# Altium project SLAVE_HW.PrjPcb (part 2 of 3)

## Sheet [2]Balancing.SchDoc
size A4 portrait; DocumentNumber: 3; SheetNumber: 3; SheetTotal: 5
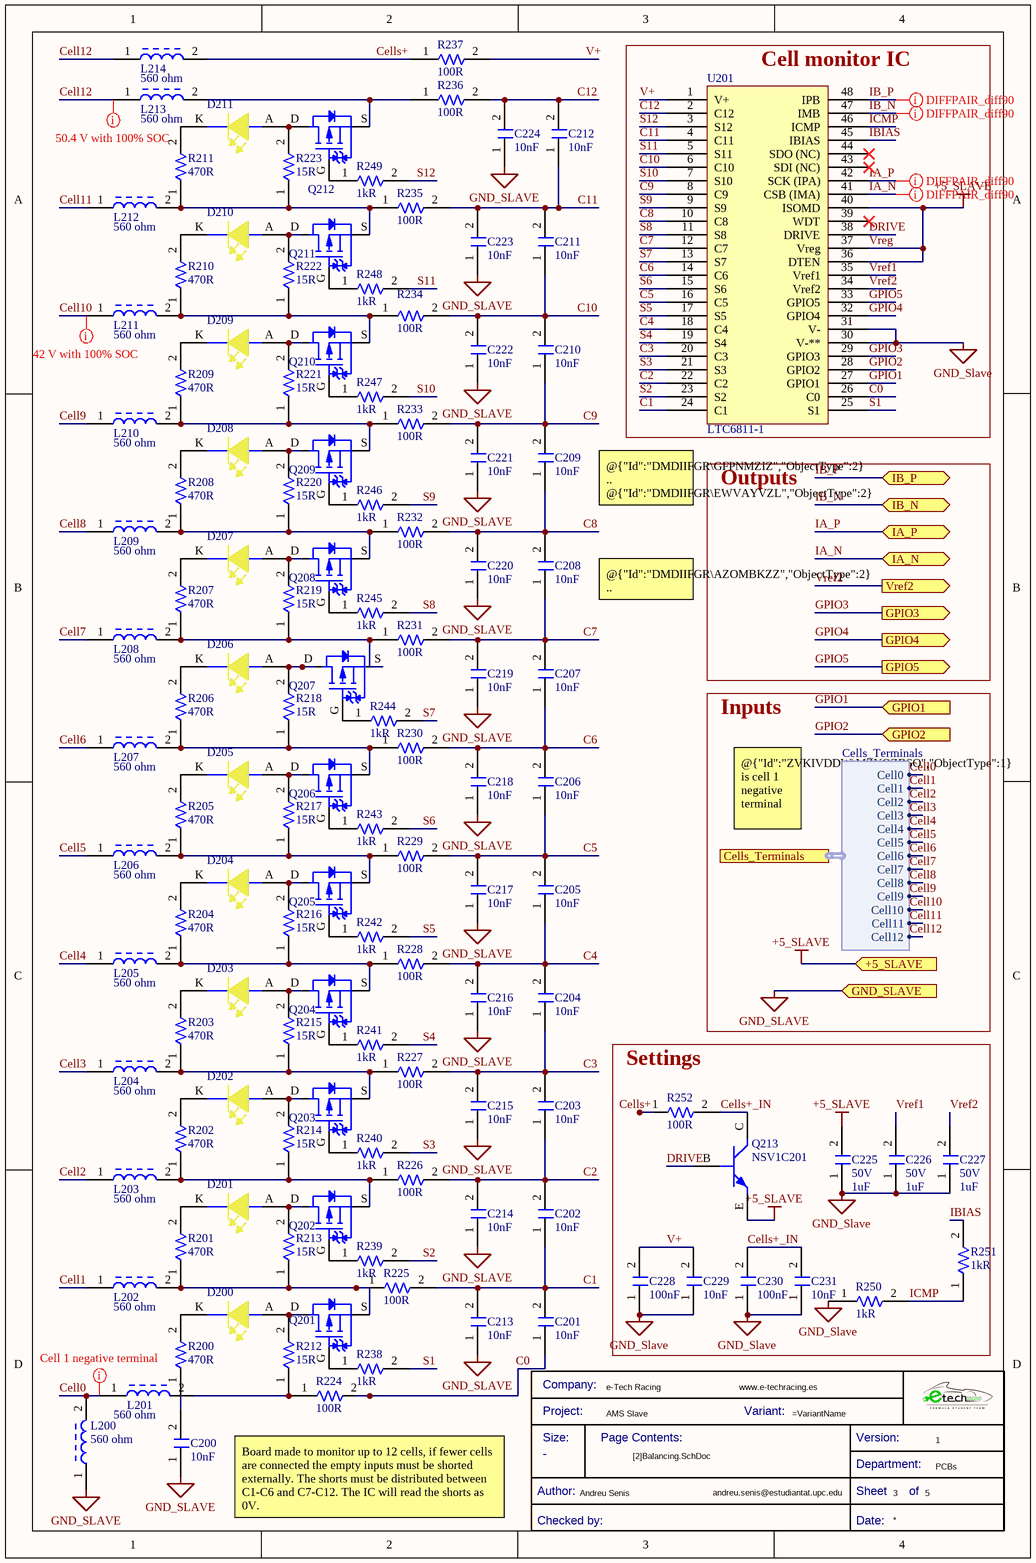
[diagram p1: [2]Balancing.SchDoc]

### Parts
(Parts that share a designator on the sheet are numbered #1, #2 ... from top to bottom, then left to right.)
*#2  Title Block_template  (value not drawn)  (graphical)
C200  Capacitance: 10nF  [C0805FNPC-R]  (hidden comment: 885012207122)
C201  Capacitance: 10nF  [C0805FNPC-R]  (hidden comment: 885012207122)
C202  Capacitance: 10nF  [C0805FNPC-R]  (hidden comment: 885012207122)
C203  Capacitance: 10nF  [C0805FNPC-R]  (hidden comment: 885012207122)
C204  Capacitance: 10nF  [C0805FNPC-R]  (hidden comment: 885012207122)
C205  Capacitance: 10nF  [C0805FNPC-R]  (hidden comment: 885012207122)
C206  Capacitance: 10nF  [C0805FNPC-R]  (hidden comment: 885012207122)
C207  Capacitance: 10nF  [C0805FNPC-R]  (hidden comment: 885012207122)
C208  Capacitance: 10nF  [C0805FNPC-R]  (hidden comment: 885012207122)
C209  Capacitance: 10nF  [C0805FNPC-R]  (hidden comment: 885012207122)
C210  Capacitance: 10nF  [C0805FNPC-R]  (hidden comment: 885012207122)
C211  Capacitance: 10nF  [C0805FNPC-R]  (hidden comment: 885012207122)
C212  Capacitance: 10nF  [C0805FNPC-R]  (hidden comment: 885012207122)
C213  Capacitance: 10nF  [C0805FNPC-R]  (hidden comment: 885012207122)
C214  Capacitance: 10nF  [C0805FNPC-R]  (hidden comment: 885012207122)
C215  Capacitance: 10nF  [C0805FNPC-R]  (hidden comment: 885012207122)
C216  Capacitance: 10nF  [C0805FNPC-R]  (hidden comment: 885012207122)
C217  Capacitance: 10nF  [C0805FNPC-R]  (hidden comment: 885012207122)
C218  Capacitance: 10nF  [C0805FNPC-R]  (hidden comment: 885012207122)
C219  Capacitance: 10nF  [C0805FNPC-R]  (hidden comment: 885012207122)
C220  Capacitance: 10nF  [C0805FNPC-R]  (hidden comment: 885012207122)
C221  Capacitance: 10nF  [C0805FNPC-R]  (hidden comment: 885012207122)
C222  Capacitance: 10nF  [C0805FNPC-R]  (hidden comment: 885012207122)
C223  Capacitance: 10nF  [C0805FNPC-R]  (hidden comment: 885012207122)
C224  Capacitance: 10nF  [C0805FNPC-R]  (hidden comment: 885012207122)
C225  Voltage Rating: 50V  Capacitance: 1uF  [C0805FNPC-R]  (hidden comment: 885012207103)
C226  Voltage Rating: 50V  Capacitance: 1uF  [C0805FNPC-R]  (hidden comment: 885012207103)
C227  Voltage Rating: 50V  Capacitance: 1uF  [C0805FNPC-R]  (hidden comment: 885012207103)
C228  Capacitance: 100nF  [C0805FNPC-R]  (hidden comment: 885012207128)
C229  Capacitance: 10nF  [C0805FNPC-R]  (hidden comment: 885012207122)
C230  Capacitance: 100nF  [C0805FNPC-R]  (hidden comment: 885012207128)
C231  Capacitance: 10nF  [C0805FNPC-R]  (hidden comment: 885012207122)
D200  150080YS75000  [LED_0805_WE]  (value not drawn)
D201  150080YS75000  [LED_0805_WE]  (value not drawn)
D202  150080YS75000  [LED_0805_WE]  (value not drawn)
D203  150080YS75000  [LED_0805_WE]  (value not drawn)
D204  150080YS75000  [LED_0805_WE]  (value not drawn)
D205  150080YS75000  [LED_0805_WE]  (value not drawn)
D206  150080YS75000  [LED_0805_WE]  (value not drawn)
D207  150080YS75000  [LED_0805_WE]  (value not drawn)
D208  150080YS75000  [LED_0805_WE]  (value not drawn)
D209  150080YS75000  [LED_0805_WE]  (value not drawn)
D210  150080YS75000  [LED_0805_WE]  (value not drawn)
D211  150080YS75000  [LED_0805_WE]  (value not drawn)
L200  560 ohm  [L_Ferrite_bead_0805]
L201  560 ohm  [L_Ferrite_bead_0805]
L202  560 ohm  [L_Ferrite_bead_0805]
L203  560 ohm  [L_Ferrite_bead_0805]
L204  560 ohm  [L_Ferrite_bead_0805]
L205  560 ohm  [L_Ferrite_bead_0805]
L206  560 ohm  [L_Ferrite_bead_0805]
L207  560 ohm  [L_Ferrite_bead_0805]
L208  560 ohm  [L_Ferrite_bead_0805]
L209  560 ohm  [L_Ferrite_bead_0805]
L210  560 ohm  [L_Ferrite_bead_0805]
L211  560 ohm  [L_Ferrite_bead_0805]
L212  560 ohm  [L_Ferrite_bead_0805]
L213  560 ohm  [L_Ferrite_bead_0805]
L214  560 ohm  [L_Ferrite_bead_0805]
Q201  BSS308PE  [TRT-PCH-2/30-BSS]  (value not drawn)
Q202  BSS308PE  [TRT-PCH-2/30-BSS]  (value not drawn)
Q203  BSS308PE  [TRT-PCH-2/30-BSS]  (value not drawn)
Q204  BSS308PE  [TRT-PCH-2/30-BSS]  (value not drawn)
Q205  BSS308PE  [TRT-PCH-2/30-BSS]  (value not drawn)
Q206  BSS308PE  [TRT-PCH-2/30-BSS]  (value not drawn)
Q207  BSS308PE  [TRT-PCH-2/30-BSS]  (value not drawn)
Q208  BSS308PE  [TRT-PCH-2/30-BSS]  (value not drawn)
Q209  BSS308PE  [TRT-PCH-2/30-BSS]  (value not drawn)
Q210  BSS308PE  [TRT-PCH-2/30-BSS]  (value not drawn)
Q211  BSS308PE  [TRT-PCH-2/30-BSS]  (value not drawn)
Q212  BSS308PE  [TRT-PCH-2/30-BSS]  (value not drawn)
Q213  NSV1C201  [TRT-NPN-2/100-SOT23_1]
R200  Resistance: 470R  [R0805FTK]  (hidden comment: CR0805-FX-4700GLF)
R201  Resistance: 470R  [R0805FTK]  (hidden comment: CR0805-FX-4700GLF)
R202  Resistance: 470R  [R0805FTK]  (hidden comment: CR0805-FX-4700GLF)
R203  Resistance: 470R  [R0805FTK]  (hidden comment: CR0805-FX-4700GLF)
R204  Resistance: 470R  [R0805FTK]  (hidden comment: CR0805-FX-4700GLF)
R205  Resistance: 470R  [R0805FTK]  (hidden comment: CR0805-FX-4700GLF)
R206  Resistance: 470R  [R0805FTK]  (hidden comment: CR0805-FX-4700GLF)
R207  Resistance: 470R  [R0805FTK]  (hidden comment: CR0805-FX-4700GLF)
R208  Resistance: 470R  [R0805FTK]  (hidden comment: CR0805-FX-4700GLF)
R209  Resistance: 470R  [R0805FTK]  (hidden comment: CR0805-FX-4700GLF)
R210  Resistance: 470R  [R0805FTK]  (hidden comment: CR0805-FX-4700GLF)
R211  Resistance: 470R  [R0805FTK]  (hidden comment: CR0805-FX-4700GLF)
R212  value 15R  [R2512FTK]  (hidden comment: 352115RFT)
R213  value 15R  [R2512FTK]  (hidden comment: 352115RFT)
R214  value 15R  [R2512FTK]  (hidden comment: 352115RFT)
R215  value 15R  [R2512FTK]  (hidden comment: 352115RFT)
R216  value 15R  [R2512FTK]  (hidden comment: 352115RFT)
R217  value 15R  [R2512FTK]  (hidden comment: 352115RFT)
R218  value 15R  [R2512FTK]  (hidden comment: 352115RFT)
R219  value 15R  [R2512FTK]  (hidden comment: 352115RFT)
R220  value 15R  [R2512FTK]  (hidden comment: 352115RFT)
R221  value 15R  [R2512FTK]  (hidden comment: 352115RFT)
R222  value 15R  [R2512FTK]  (hidden comment: 352115RFT)
R223  value 15R  [R2512FTK]  (hidden comment: 352115RFT)
R224  Resistance: 100R  [R0805FTK]  (hidden comment: CR0805-FX-1000ELF)
R225  Resistance: 100R  [R0805FTK]  (hidden comment: CR0805-FX-1000ELF)
R226  Resistance: 100R  [R0805FTK]  (hidden comment: CR0805-FX-1000ELF)
R227  Resistance: 100R  [R0805FTK]  (hidden comment: CR0805-FX-1000ELF)
R228  Resistance: 100R  [R0805FTK]  (hidden comment: CR0805-FX-1000ELF)
R229  Resistance: 100R  [R0805FTK]  (hidden comment: CR0805-FX-1000ELF)
R230  Resistance: 100R  [R0805FTK]  (hidden comment: CR0805-FX-1000ELF)
R231  Resistance: 100R  [R0805FTK]  (hidden comment: CR0805-FX-1000ELF)
R232  Resistance: 100R  [R0805FTK]  (hidden comment: CR0805-FX-1000ELF)
R233  Resistance: 100R  [R0805FTK]  (hidden comment: CR0805-FX-1000ELF)
R234  Resistance: 100R  [R0805FTK]  (hidden comment: CR0805-FX-1000ELF)
R235  Resistance: 100R  [R0805FTK]  (hidden comment: CR0805-FX-1000ELF)
R236  Resistance: 100R  [R0805FTK]  (hidden comment: CR0805-FX-1000ELF)
R237  Resistance: 100R  [R0805FTK]  (hidden comment: CR0805-FX-1000ELF)
R238  Resistance: 1kR  [R0805FTK]  (hidden comment: CR0805-JW-102ELF)
R239  Resistance: 1kR  [R0805FTK]  (hidden comment: CR0805-JW-102ELF)
R240  Resistance: 1kR  [R0805FTK]  (hidden comment: CR0805-JW-102ELF)
R241  Resistance: 1kR  [R0805FTK]  (hidden comment: CR0805-JW-102ELF)
R242  Resistance: 1kR  [R0805FTK]  (hidden comment: CR0805-JW-102ELF)
R243  Resistance: 1kR  [R0805FTK]  (hidden comment: CR0805-JW-102ELF)
R244  Resistance: 1kR  [R0805FTK]  (hidden comment: CR0805-JW-102ELF)
R245  Resistance: 1kR  [R0805FTK]  (hidden comment: CR0805-JW-102ELF)
R246  Resistance: 1kR  [R0805FTK]  (hidden comment: CR0805-JW-102ELF)
R247  Resistance: 1kR  [R0805FTK]  (hidden comment: CR0805-JW-102ELF)
R248  Resistance: 1kR  [R0805FTK]  (hidden comment: CR0805-JW-102ELF)
R249  Resistance: 1kR  [R0805FTK]  (hidden comment: CR0805-JW-102ELF)
R250  Resistance: 1kR  [R0805FTK]  (hidden comment: CR0805-JW-102ELF)
R251  Resistance: 1kR  [R0805FTK]  (hidden comment: CR0805-JW-102ELF)
R252  Resistance: 100R  [R0805FTK]  (hidden comment: CR0805-FX-1000ELF)
U201  LTC6811-1  [U_LTC6811G-2]

### Blocks framed on the sheet
Cell monitor IC: U201
Settings: C225-C231 Q213 R250-R252

### Ports
+5_SLAVE (in), Cells_Terminals (harness Cells_Terminals), GND_SLAVE (in), GPIO1 (in), GPIO2 (in), GPIO3 (out), GPIO4 (out), GPIO5 (out), IA_N (bidir), IA_P (bidir), IB_N (bidir), IB_P (bidir), Vref2 (out)

### Harnesses
Cells_Terminals: Cell0, Cell1, Cell2, Cell3, Cell4, Cell5, Cell6, Cell7, Cell8, Cell9, Cell10, Cell11, Cell12

### Nets
GND_SLAVE: C200.1 C213.1 C214.1 C215.1 C216.1 C217.1 C218.1 C219.1 C220.1 C221.1 C222.1 C223.1 C224.1 C225.1 C226.1 C227.1 C228.1 C229.1 C230.1 C231.1 L200.1 R250.1 U201.30(V-**) U201.31(V-) ; port GND_SLAVE
Vreg: C225.2 Q213.E U201.36(DTEN) U201.37(Vreg) U201.40(ISOMD) ; port +5_SLAVE  [also labelled +5_SLAVE]
C0: C201.1 R224.2 U201.26(C0)
C1: C201.2 C202.1 C213.2 R225.2 U201.24(C1)
C2: C202.2 C203.1 C214.2 R226.2 U201.22(C2)
C3: C203.2 C204.1 C215.2 R227.2 U201.20(C3)
C4: C204.2 C205.1 C216.2 R228.2 U201.18(C4)
C5: C205.2 C206.1 C217.2 R229.2 U201.16(C5)
C6: C206.2 C207.1 C218.2 R230.2 U201.14(C6)
C7: C207.2 C208.1 C219.2 R231.2 U201.12(C7)
C8: C208.2 C209.1 C220.2 R232.2 U201.10(C8)
C9: C209.2 C210.1 C221.2 R233.2 U201.8(C9)
C10: C210.2 C211.1 C222.2 R234.2 U201.6(C10)
C11: C211.2 C212.1 C223.2 R235.2 U201.4(C11)
C12: C212.2 C224.2 R236.2 U201.2(C12)
Cell0: L200.2 L201.1 ; port Cells_Terminals.Cell0
Cell1: L202.1 ; port Cells_Terminals.Cell1
Cell2: L203.1 ; port Cells_Terminals.Cell2
Cell3: L204.1 ; port Cells_Terminals.Cell3
Cell4: L205.1 ; port Cells_Terminals.Cell4
Cell5: L206.1 ; port Cells_Terminals.Cell5
Cell6: L207.1 ; port Cells_Terminals.Cell6
Cell7: L208.1 ; port Cells_Terminals.Cell7
Cell8: L209.1 ; port Cells_Terminals.Cell8
Cell9: L210.1 ; port Cells_Terminals.Cell9
Cell10: L211.1 ; port Cells_Terminals.Cell10
Cell11: L212.1 ; port Cells_Terminals.Cell11
Cell12: L213.1 L214.1 ; port Cells_Terminals.Cell12
Cells+: L214.2 R237.1 R252.1
Cells+_IN: C230.2 C231.2 Q213.C R252.2
DRIVE: Q213.B U201.38(DRIVE)
GPIO1: U201.27(GPIO1) ; port GPIO1
GPIO2: U201.28(GPIO2) ; port GPIO2
GPIO3: U201.29(GPIO3) ; port GPIO3
GPIO4: U201.32(GPIO4) ; port GPIO4
GPIO5: U201.33(GPIO5) ; port GPIO5
IA_N: U201.41(CSB_(IMA)) ; port IA_N
IA_P: U201.42(SCK_(IPA)) ; port IA_P
IB_N: U201.47(IMB) ; port IB_N
IB_P: U201.48(IPB) ; port IB_P
IBIAS: R251.2 U201.45(IBIAS)
ICMP: R250.2 R251.1 U201.46(ICMP)
S1: R238.2 U201.25(S1)
S2: R239.2 U201.23(S2)
S3: R240.2 U201.21(S3)
S4: R241.2 U201.19(S4)
S5: R242.2 U201.17(S5)
S6: R243.2 U201.15(S6)
S7: R244.2 U201.13(S7)
S8: R245.2 U201.11(S8)
S9: R246.2 U201.9(S9)
S10: R247.2 U201.7(S10)
S11: R248.2 U201.5(S11)
S12: R249.2 U201.3(S12)
V+: C228.2 C229.2 R237.2 U201.1(V+)
Vref1: C226.2 U201.35(Vref1)
Vref2: C227.2 U201.34(Vref2) ; port Vref2
NetC200_2: C200.2 R200.1
NetD200_A: D200.A Q201.D R212.2
NetD200_K: D200.K R200.2
NetD201_A: D201.A Q202.D R213.2
NetD201_K: D201.K R201.2
NetD202_A: D202.A Q203.D R214.2
NetD202_K: D202.K R202.2
NetD203_A: D203.A Q204.D R215.2
NetD203_K: D203.K R203.2
NetD204_A: D204.A Q205.D R216.2
NetD204_K: D204.K R204.2
NetD205_A: D205.A Q206.D R217.2
NetD205_K: D205.K R205.2
NetD206_A: D206.A Q207.D R218.2
NetD206_K: D206.K R206.2
NetD207_A: D207.A Q208.D R219.2
NetD207_K: D207.K R207.2
NetD208_A: D208.A Q209.D R220.2
NetD208_K: D208.K R208.2
NetD209_A: D209.A Q210.D R221.2
NetD209_K: D209.K R209.2
NetD210_A: D210.A Q211.D R222.2
NetD210_K: D210.K R210.2
NetD211_A: D211.A Q212.D R223.2
NetD211_K: D211.K R211.2
NetL201_2: L201.2 R212.1 R224.1
NetL202_2: L202.2 Q201.S R201.1 R213.1 R225.1
NetL203_2: L203.2 Q202.S R202.1 R214.1 R226.1
NetL204_2: L204.2 Q203.S R203.1 R215.1 R227.1
NetL205_2: L205.2 Q204.S R204.1 R216.1 R228.1
NetL206_2: L206.2 Q205.S R205.1 R217.1 R229.1
NetL207_2: L207.2 Q206.S R206.1 R218.1 R230.1
NetL208_2: L208.2 Q207.S R207.1 R219.1 R231.1
NetL209_2: L209.2 Q208.S R208.1 R220.1 R232.1
NetL210_2: L210.2 Q209.S R209.1 R221.1 R233.1
NetL211_2: L211.2 Q210.S R210.1 R222.1 R234.1
NetL212_2: L212.2 Q211.S R211.1 R223.1 R235.1
NetL213_2: L213.2 Q212.S R236.1
NetQ201_G: Q201.G R238.1
NetQ202_G: Q202.G R239.1
NetQ203_G: Q203.G R240.1
NetQ204_G: Q204.G R241.1
NetQ205_G: Q205.G R242.1
NetQ206_G: Q206.G R243.1
NetQ207_G: Q207.G R244.1
NetQ208_G: Q208.G R245.1
NetQ209_G: Q209.G R246.1
NetQ210_G: Q210.G R247.1
NetQ211_G: Q211.G R248.1
NetQ212_G: Q212.G R249.1

Not connected (* = marked no-connect by the designer): U201 39(WDT)* 43(SDI_(NC))* 44(SDO_(NC))*

### Layout directives
mark named Cell 1 negative terminal: Cell0
mark named 42 V with 100% SOC: Cell10
differential pair; differential pair class diff90: IA_N, IA_P, IB_N, IB_P
mark named 50.4 V with 100% SOC: Cell12

### Notes on the sheet
- @{"Id":"DMDIIFGR\GFPNMZIZ","ObjectType":2} .. @{"Id":"DMDIIFGR\EWVAYVZL","ObjectType":2}
  352115RFT
  1.2W balancing
- Outputs
- @{"Id":"DMDIIFGR\AZOMBKZZ","ObjectType":2} .. @{"Id":"DMDIIFGR\FENBVGVP","ObjectType":2}
  BSS308PE
- Inputs
- @{"Id":"ZVKIVDDW\MZYQZBSO","ObjectType":1} is cell 1 negative terminal
- Board made to monitor up to 12 cells, if fewer cells are connected the empty inputs must be shorted externally. The shorts must be distributed between C1-C6 and C7-C12. The IC will read the shorts as 0V.
- (in symbol Title Block_template) Company:; Project:; Variant:; Size:; Page Contents:; Version:; Department:; Author:; Sheet; of; Checked by:; Date:

### Library data of the parts
*#2 = Title Block_template: Standard Title Block; .Creator: GP; Category: Title Block; .PCBcheck: GP; .SCHcheck: GP; Size: -
C200-C224 C229 C231 = C10n-100V-0805FNPC-X7R: Cap Cer 10000PF 100V X7R 0805; Manufacturer 1: Wurth Electronics; Manufacturer Part Number 1: 885012207092; Voltage Rating: 50V; Tolerance: 10%; .Creator: DR; Value: 10nF; Insulation Resistance: 10GR; Supplier 1: RSComponents; RoHS: Yes; Category: Ceramic Capacitors; Stock 1: 1; Pricing 1: 4000=0,03200, 12000=0,03100 (USD); Mount: Surface Mount; Case/Package: 0805; Case Code (Metric): 2012; Case Code (Imperial): 0805; Min Operating Temperature: -55°C; Max Operating Temperature: 125°C; Packaging: Cut Tape; Dielectric: X7R; Voltage Rating (DC): 50V; Length: 0.079inch; Width: 0.049inch; Thickness: 0.035inch; REACH SVHC: Unknown; RoHS Compliant: Yes; ComponentLink1URL: http://www.farnell.com/datasheets/1958497.pdf?src-supplier=Farnell; ComponentLink1Description: http://www.farnell.com/datasheets/1958497.pdf?src-supplier=Farnell; ComponentLink2URL: http://www.farnell.com/datasheets/1958497.pdf?src-supplier=Element14; ComponentLink2Description: http://www.farnell.com/datasheets/1958497.pdf?src-supplier=Element14; ComponentLink3URL: http://www.farnell.com/datasheets/1958497.pdf?src-supplier=Newark; ComponentLink3Description: http://www.farnell.com/datasheets/1958497.pdf?src-supplier=Newark; ComponentLink4URL: https://katalog.we-online.de/pbs/datasheet/885012207092.pdf?src-supplier=Digi-Key; ComponentLink4Description: https://katalog.we-online.de/pbs/datasheet/885012207092.pdf?src-supplier=Digi-Key; Supplier Part Number 1: 1813941; Supplier 2: Digi-Key; Manufacturer: Wurth Electronics; Manufacturer Part Number: 885012207122; Stock 2: 7435; Pricing 2: 1=0,1, 10=0,043, 100=0,039, 500=0,034 (USD); Height: 800um; ComponentLink5URL: http://www.farnell.com/datasheets/2546912.pdf?src-supplier=Farnell; ComponentLink5Description: http://www.farnell.com/datasheets/2546912.pdf?src-supplier=Farnell; ComponentLink6URL: http://www.farnell.com/datasheets/2546912.pdf?src-supplier=Newark; ComponentLink6Description: http://www.farnell.com/datasheets/2546912.pdf?src-supplier=Newark; ComponentLink7URL: https://katalog.we-online.de/pbs/datasheet/885012207122.pdf?src-supplier=Digi-Key; ComponentLink7Description: https://katalog.we-online.de/pbs/datasheet/885012207122.pdf?src-supplier=Digi-Key; Supplier Part Number 2: 732-12139-1-ND
C225-C227 = C1u-50V-0805FNPC-X7R: Multilayer Ceramic Capacitor, Wcap-Csgp Series, 1 F, 10%, X7R, 50 V, 0805 [2012 Metric] Rohs Compliant: Yes; Manufacturer 1: Wurth Electronics; .Creator: GP; Supplier 1: RSComponents; Manufacturer Part Number 1: 885012207103; RoHS: Yes; Category: Ceramic Capacitors; Stock 1: 5100; Pricing 1: 50=0,27200, 250=0,25300, 500=0,22800, 1250=0,20100, 2500=0,17100 (GBP); Mount: Surface Mount; Case/Package: 0805; Case Code (Metric): 2012; Case Code (Imperial): 0805; Min Operating Temperature: -55°C; Max Operating Temperature: 85°C; Packaging: Cut Tape; Dielectric: X7R; Tolerance: 10%; Voltage Rating (DC): 50V; Length: 0.079inch; Width: 0.049inch; Thickness: 0.053inch; REACH SVHC: Unknown; RoHS Compliant: Yes; ComponentLink1URL: http://www.farnell.com/datasheets/1958501.pdf?src-supplier=Farnell; ComponentLink1Description: http://www.farnell.com/datasheets/1958501.pdf?src-supplier=Farnell; ComponentLink2URL: http://www.farnell.com/datasheets/1958501.pdf?src-supplier=Element14; ComponentLink2Description: http://www.farnell.com/datasheets/1958501.pdf?src-supplier=Element14; ComponentLink3URL: https://katalog.we-online.de/pbs/datasheet/885012107003.pdf?src-supplier=Digi-Key; ComponentLink3Description: https://katalog.we-online.de/pbs/datasheet/885012107003.pdf?src-supplier=Digi-Key; ComponentLink4URL: http://www.farnell.com/datasheets/1958501.pdf?src-supplier=Newark; ComponentLink4Description: http://www.farnell.com/datasheets/1958501.pdf?src-supplier=Newark; Supplier Part Number 1: 1813523
C228 C230 = C100n-100V-0805FNPC-X7R: 0.1μF ±10% 100V Ceramic Capacitor X7R 0805 (2012 Metric); Manufacturer 1: Wurth Electronics; Manufacturer Part Number 1: 885012207098; Voltage Rating: 50V; .Creator: DR; Material: 4241ConductorMaterial; Insulation Resistance: 1GR; Supplier 1: RSComponents; RoHS: Yes; Category: Ceramic Capacitors; Stock 1: 8000; Pricing 1: 100=0,10200, 500=0,07100, 2000=0,06100 (GBP); Mount: Surface Mount; Case/Package: 0805; Case Code (Metric): 2012; Case Code (Imperial): 0805; Min Operating Temperature: -55°C; Max Operating Temperature: 125°C; Packaging: Cut Tape; Dielectric: X7R; Tolerance: 10%; Voltage Rating (DC): 50V; Length: 0.079inch; Width: 0.049inch; Thickness: 0.035inch; REACH SVHC: Unknown; RoHS Compliant: Yes; ComponentLink1URL: http://www.farnell.com/datasheets/1958498.pdf?src-supplier=Farnell; ComponentLink1Description: http://www.farnell.com/datasheets/1958498.pdf?src-supplier=Farnell; ComponentLink2URL: http://www.farnell.com/datasheets/1958498.pdf?src-supplier=Element14; ComponentLink2Description: http://www.farnell.com/datasheets/1958498.pdf?src-supplier=Element14; ComponentLink3URL: https://katalog.we-online.de/pbs/datasheet/885012207098.pdf?src-supplier=Digi-Key; ComponentLink3Description: https://katalog.we-online.de/pbs/datasheet/885012207098.pdf?src-supplier=Digi-Key; ComponentLink4URL: http://www.farnell.com/datasheets/1958498.pdf?src-supplier=Newark; ComponentLink4Description: http://www.farnell.com/datasheets/1958498.pdf?src-supplier=Newark; Supplier Part Number 1: 1813493; Supplier 2: Digi-Key; Manufacturer: Wurth Electronics; Manufacturer Part Number: 885012207128; Stock 2: 19198; Pricing 2: 1=0,1, 10=0,088, 100=0,078, 500=0,069 (USD); Height: 1.25mm; ComponentLink5URL: http://www.farnell.com/datasheets/2546917.pdf?src-supplier=Farnell; ComponentLink5Description: http://www.farnell.com/datasheets/2546917.pdf?src-supplier=Farnell; ComponentLink6URL: http://www.farnell.com/datasheets/2546917.pdf?src-supplier=Element14; ComponentLink6Description: http://www.farnell.com/datasheets/2546917.pdf?src-supplier=Element14; ComponentLink7URL: http://www.farnell.com/datasheets/2546917.pdf?src-supplier=Newark; ComponentLink7Description: http://www.farnell.com/datasheets/2546917.pdf?src-supplier=Newark; ComponentLink8URL: https://katalog.we-online.de/pbs/datasheet/885012207128.pdf?src-supplier=Digi-Key; ComponentLink8Description: https://katalog.we-online.de/pbs/datasheet/885012207128.pdf?src-supplier=Digi-Key; Supplier Part Number 2: 732-12244-1-ND
D200-D211 = LEDYS-0805-120: 2 V Yellow LED 2012 (0805) SMD, Wurth Elektronik WL-SMCW 150080YS75000; Manufacturer 1: Wurth Electronics; Luminous Intensity: 120mcd; Forward Current: 30mA; Forward Voltage: 2V; Viewing Angle: 140°; Wavelength: 590nm; Lens Style: Clear,Rectangular; Test Current: 20mA; .Creator: DR; ComponentLink1Description: Datasheet; ComponentLink1URL: https://www.we-online.com/catalog/datasheet/150080YS75000.pdf; ComponentLink2Description: Where buy it; ComponentLink2URL: https://katalog.we-online.de/en/led/WL-SMCW/150080YS75000; Supplier 1: RSComponents; Manufacturer Part Number 1: 150080YS75000; RoHS: Yes; Category: LEDs; Stock 1: 2100; Pricing 1: 50=0,19300, 500=0,12900, 750=0,12300, 1500=0,11700, 3000=0,11100 (USD); Mount: Surface Mount; Case/Package: 0805; Case Code (Metric): 2012; Case Code (Imperial): 0805; Min Operating Temperature: -40°C; Max Operating Temperature: 85°C; Package Quantity: 4000; Packaging: Tape and Reel; Dominant Wavelength: 590nm; Length: 2mm; Width: 1.25mm; Height: 0.7mm; REACH SVHC: Unknown; RoHS Compliant: Yes; ComponentLink3URL: https://datasheet.ciiva.com/23843/150080ys75000-23843256.pdf?src-supplier=Newark; ComponentLink3Description: https://datasheet.ciiva.com/23843/150080ys75000-23843256.pdf?src-supplier=Newark; ComponentLink4URL: https://datasheet.ciiva.com/29279/759438-da-01-en-chipled-0805-w-kl-gelb-150080ys75000-29279034.pdf?src-supplier=Conrad; ComponentLink4Description: https://datasheet.ciiva.com/29279/759438-da-01-en-chipled-0805-w-kl-gelb-150080ys75000-29279034.pdf?src-supplier=Conrad; ComponentLink5URL: https://datasheet.ciiva.com/22656/1911353-22656971.pdf?src-supplier=Element14; ComponentLink5Description: https://datasheet.ciiva.com/22656/1911353-22656971.pdf?src-supplier=Element14; ComponentLink6URL: https://datasheet.ciiva.com/29563/150080ys75000-29563019.pdf?src-supplier=Digi-Key; ComponentLink6Description: https://datasheet.ciiva.com/29563/150080ys75000-29563019.pdf?src-supplier=Digi-Key; ComponentLink7URL: https://datasheet.ciiva.com/29563/150080ys75000-29563020.pdf?src-supplier=Digi-Key; ComponentLink7Description: https://datasheet.ciiva.com/29563/150080ys75000-29563020.pdf?src-supplier=Digi-Key; ComponentLink8URL: https://datasheet.ciiva.com/29563/150080ys75000-29563021.pdf?src-supplier=Digi-Key; ComponentLink8Description: https://datasheet.ciiva.com/29563/150080ys75000-29563021.pdf?src-supplier=Digi-Key; Supplier Part Number 1: 8154231; Color: Yellow
L200-L214 = L_Ferrite_bead_782853561: Manufacturer: Murata; Manufacturer Part Number: BLM18EG331TN1D; Material: Ferrite,Steel; Impedance: 330R; DC Resistance (DCR): 210mR; Tolerance: 25%; Current Rating: 500mA; Number of Lines: 1; Test Frequency: 100MHz; .Creator: GP; Supplier 1: Digi-Key; RoHS: Yes; Category: Ferrite Beads and Chips; Stock 1: 20037; Pricing 1: 1=0,23000, 10=0,17500, 25=0,14520, 50=0,12520, 100=0,11260, 250=0,09508, 500=0,08508, 1000=0,07257 (USD); Case/Package: 0603; Number of Pins: 2; Core Material: Ferrite; Case Code (Metric): 1608; Case Code (Imperial): 0603; Min Operating Temperature: -55°C; Max Operating Temperature: 125°C; Packaging: Tape and Reel; Max DC Current: 500mA; Number of Circuits: 1; Package Quantity: 1; Max Current Rating: 500mA; Termination: SMD/SMT; Series: BLM18E; Resistance: 210mR; Length: 1.6mm; Width: 0.8mm; Height: 0.8mm; Depth: 0.8mm; REACH SVHC: No SVHC; Lead Free: Lead Free; RoHS Compliant: Yes; ComponentLink1URL: https://datasheet.ciiva.com/1467/5169-1467232.pdf?src-supplier=Element14; ComponentLink1Description: https://datasheet.ciiva.com/1467/5169-1467232.pdf?src-supplier=Element14; ComponentLink2URL: https://datasheet.ciiva.com/11795/0900766b811b5866-11795405.pdf?src-supplier=RSComponents; ComponentLink2Description: https://datasheet.ciiva.com/11795/0900766b811b5866-11795405.pdf?src-supplier=RSComponents; ComponentLink3URL: https://datasheet.ciiva.com/41449/001172267-da-01-en-drossel-0603-330r-1-6x0-8mm-4000st-41449581.pdf?src-supplier=Conrad; ComponentLink3Description: https://datasheet.ciiva.com/41449/001172267-da-01-en-drossel-0603-330r-1-6x0-8mm-4000st-41449581.pdf?src-supplier=Conrad; ComponentLink4URL: https://datasheet.ciiva.com/1467/5169-1467233.pdf?src-supplier=Element14; ComponentLink4Description: https://datasheet.ciiva.com/1467/5169-1467233.pdf?src-supplier=Element14; ComponentLink5URL: https://datasheet.ciiva.com/1561/5169-1561345.pdf?src-supplier=Newark; ComponentLink5Description: https://datasheet.ciiva.com/1561/5169-1561345.pdf?src-supplier=Newark; ComponentLink6URL: https://datasheet.ciiva.com/3082/l0110s0101blm18e-3082714.pdf?src-supplier=Avnet; ComponentLink6Description: https://datasheet.ciiva.com/3082/l0110s0101blm18e-3082714.pdf?src-supplier=Avnet; ComponentLink7URL: https://datasheet.ciiva.com/6211/l0110s0101blm18e-6211470.pdf?src-supplier=Digi-Key; ComponentLink7Description: https://datasheet.ciiva.com/6211/l0110s0101blm18e-6211470.pdf?src-supplier=Digi-Key; ComponentLink8URL: https://datasheet.ciiva.com/6211/l0110s0101blm18e-6211471.pdf?src-supplier=Digi-Key; ComponentLink8Description: https://datasheet.ciiva.com/6211/l0110s0101blm18e-6211471.pdf?src-supplier=Digi-Key; Supplier Part Number 1: 490-5913-1-ND
Q201-Q211 = TRT-PCH-2/30-BSS: Infineon’s highly innovative OptiMOS™ families include p-channel power MOSFETs, SOT-23-3, RoHS; Manufacturer Part Number: BSS308PEH6327; Max Power Dissipation: 500mW; .Creator: DO; Continuous Drain Current (ID): 2A; Input Capacitance: 500pF; Drain to Source Voltage (Vdss): 30V; Gate to Source Voltage (Vgs): 20V; Rds On Max: 80mR; Rise Time: 7.7ns; Turn-Off Delay Time: 15.3ns; Fall Time: 2.8ns; Turn-On Delay Time: 5.6ns; Threshold Voltage: -1.5V; Manufacturer: Infineon; ComponentLink1Description: datasheet; ComponentLink1URL: https://datasheet.ciiva.com/6379/infineon-bss308pe-ds-v02-03-en-6379920.pdf?src-supplier=Digi-Key; ComponentLink2Description: https://datasheet.ciiva.com/11171/infineon-bss308pe-ds-v02-03-en-11171385.pdf?src-supplier=Avnet; ComponentLink2URL: https://datasheet.ciiva.com/11171/infineon-bss308pe-ds-v02-03-en-11171385.pdf?src-supplier=Avnet; Supplier 1: RSComponents; RoHS: Yes; Category: MOSFETs; Pricing 1: 50=0,50300, 100=0,26400, 250=0,25900, 500=0,25200, 1000=0,24700 (USD); Case/Package: TO-236-3; Number of Pins: 3; Min Operating Temperature: -55°C; Max Operating Temperature: 150°C; Packaging: Tape and Reel; Package Quantity: 1; Series: OptiMOS™; REACH SVHC: No SVHC; Supplier Part Number 1: 8235500; Stock 1: 4000; Mount: Surface Mount
Q212 = TRT-PCH-2/30-BSS: Infineon’s highly innovative OptiMOS™ families include p-channel power MOSFETs, SOT-23-3, RoHS; Manufacturer Part Number: BSS308PEH6327; Continuous Drain Current (ID): 2A; Input Capacitance: 500pF; Drain to Source Voltage (Vdss): 30V; Max Power Dissipation: 500mW; Gate to Source Voltage (Vgs): 20V; Rds On Max: 80mR; Rise Time: 7.7ns; Turn-Off Delay Time: 15.3ns; Fall Time: 2.8ns; Turn-On Delay Time: 5.6ns; Threshold Voltage: -1.5V; .Creator: DO; Supplier 1: RSComponents; Manufacturer: Infineon; RoHS: Yes; Category: MOSFETs; Stock 1: 4000; Pricing 1: 50=0,50300, 100=0,26400, 250=0,25900, 500=0,25200, 1000=0,24700 (USD); Mount: Surface Mount; Case/Package: TO-236-3; Number of Pins: 3; Min Operating Temperature: -55°C; Max Operating Temperature: 150°C; Packaging: Tape and Reel; Package Quantity: 1; Series: OptiMOS™; REACH SVHC: No SVHC; ComponentLink1URL: https://datasheet.ciiva.com/6379/infineon-bss308pe-ds-v02-03-en-6379920.pdf?src-supplier=Digi-Key; ComponentLink1Description: datasheet; ComponentLink2URL: https://datasheet.ciiva.com/11171/infineon-bss308pe-ds-v02-03-en-11171385.pdf?src-supplier=Avnet; ComponentLink2Description: https://datasheet.ciiva.com/11171/infineon-bss308pe-ds-v02-03-en-11171385.pdf?src-supplier=Avnet; Supplier Part Number 1: 8235500
Q213 = TRT-NPN-2/100-SOT23: NPN Ic=2A Vceo=100V hfe=40~360 P=800mW; Collector Emitter Voltage (VCEO): 45V; Max Collector Current: 500mA; Collector Base Voltage (VCBO): 50V; Power Dissipation: 300mW; hFE Min: 160; Transition Frequency: 100MHz; Emitter Base Voltage (VEBO): 5V; Element Configuration: Single; Collector-emitter Voltage-Max: 700mV; Number of Elements: 1; .Creator: GP; Category: Transistor; ComponentLink1Description: Datasheet; ComponentLink1URL: *; ComponentLink2Description: Where buy it; ComponentLink2URL: *; Package: *; Type: *; Manufacturer: *; Manufacturer part number: *; Supplier: *; Packaging: *; Max operating temperature: *; Min operating temperature: *; Max power dissipation: *; Power rating: *; RoHS: *; Polarity: *; Vce max: *; Ic max: *; Gain: *; Supplier 1: Digi-Key; Pricing 1: 1=0,20000, 10=0,18500, 100=0,10080, 500=0,06204, 1000=0,04229 (USD); Case/Package: SOT-23-3; Number of Pins: 3; Contact Plating: Tin,Matte; Package Quantity: 1; Collector Emitter Breakdown Voltage: 45V; Max Breakdown Voltage: 45V; Max Frequency: 100MHz; Current Rating: 500mA; Series: -; Frequency: 100MHz; Collector Emitter Saturation Voltage: 700mV; Gain Bandwidth Product: 100MHz; Length: 2.9mm; Width: 1.3mm; Height: 0.94mm; Radiation Hardening: No; Lead Free: Lead Free; Halogen Free: Halogen Free; RoHS Compliant: Yes; REACH SVHC: No SVHC; ComponentLink3URL: https://datasheet.ciiva.com/27748/2010413-27748829.pdf?src-supplier=Jameco; ComponentLink3Description: https://datasheet.ciiva.com/27748/2010413-27748829.pdf?src-supplier=Jameco; ComponentLink4URL: https://datasheet.ciiva.com/15138/getdatasheetpartid-38405-15138602.pdf?src-supplier=Verical; ComponentLink4Description: https://datasheet.ciiva.com/15138/getdatasheetpartid-38405-15138602.pdf?src-supplier=Verical; ComponentLink5URL: https://datasheet.ciiva.com/1196/bc817-16lt1-d-1196558.pdf?src-supplier=Element14; ComponentLink5Description: https://datasheet.ciiva.com/1196/bc817-16lt1-d-1196558.pdf?src-supplier=Element14; ComponentLink6URL: https://datasheet.ciiva.com/22641/bc817-16lt1-d-22641013.pdf?src-supplier=Farnell; ComponentLink6Description: https://datasheet.ciiva.com/22641/bc817-16lt1-d-22641013.pdf?src-supplier=Farnell; ComponentLink7URL: https://datasheet.ciiva.com/22664/bc817-16lt1-d-22664204.pdf?src-supplier=Element14; ComponentLink7Description: https://datasheet.ciiva.com/22664/bc817-16lt1-d-22664204.pdf?src-supplier=Element14; ComponentLink8URL: https://datasheet.ciiva.com/22664/1842041-22664101.pdf?src-supplier=Element14; ComponentLink8Description: https://datasheet.ciiva.com/22664/1842041-22664101.pdf?src-supplier=Element14; ComponentLink9URL: https://datasheet.ciiva.com/4722/bc817-16lt1-d-104560-4722229.pdf?src-supplier=Mouser; ComponentLink9Description: https://datasheet.ciiva.com/4722/bc817-16lt1-d-104560-4722229.pdf?src-supplier=Mouser; ComponentLink10URL: https://datasheet.ciiva.com/1195/bc817-16lt1-d-1195763.pdf?src-supplier=Element14; ComponentLink10Description: https://datasheet.ciiva.com/1195/bc817-16lt1-d-1195763.pdf?src-supplier=Element14; ComponentLink11URL: https://datasheet.ciiva.com/1195/bc817-16lt1-d-1195764.pdf?src-supplier=Element14; ComponentLink11Description: https://datasheet.ciiva.com/1195/bc817-16lt1-d-1195764.pdf?src-supplier=Element14; ComponentLink12URL: https://datasheet.ciiva.com/11197/bc817-16lt1-d-11197514.pdf?src-supplier=Avnet; ComponentLink12Description: https://datasheet.ciiva.com/11197/bc817-16lt1-d-11197514.pdf?src-supplier=Avnet; ComponentLink13URL: https://datasheet.ciiva.com/25996/bc817-16lt1-d-25996327.pdf?src-supplier=Avnet+Europe; ComponentLink13Description: https://datasheet.ciiva.com/25996/bc817-16lt1-d-25996327.pdf?src-supplier=Avnet+Europe; ComponentLink14URL: https://datasheet.ciiva.com/976/bc817-16lt1-d-976357.pdf?src-supplier=Digi-Key; ComponentLink14Description: https://datasheet.ciiva.com/976/bc817-16lt1-d-976357.pdf?src-supplier=Digi-Key; ComponentLink15URL: https://datasheet.ciiva.com/976/bc817-16lt1-d-976358.pdf?src-supplier=Digi-Key; ComponentLink15Description: https://datasheet.ciiva.com/976/bc817-16lt1-d-976358.pdf?src-supplier=Digi-Key; ComponentLink16URL: https://datasheet.ciiva.com/976/bc817-16lt1-d-976356.pdf?src-supplier=Digi-Key; ComponentLink16Description: https://datasheet.ciiva.com/976/bc817-16lt1-d-976356.pdf?src-supplier=Digi-Key; Supplier Part Number 1: BC817-25LT1GOSCT-ND; Supplier 2: Digi-Key; Stock 2: 25941; Pricing 2: 1=0,62, 10=0,53, 100=0,3682, 500=0,28746 (USD); ComponentLink17URL: http://www.farnell.com/datasheets/2237003.pdf?src-supplier=Farnell; ComponentLink17Description: http://www.farnell.com/datasheets/2237003.pdf?src-supplier=Farnell; ComponentLink18URL: http://www.mouser.com/ds/2/308/NSS1C201MZ4-D-356308.pdf?src-supplier=Mouser; ComponentLink18Description: http://www.mouser.com/ds/2/308/NSS1C201MZ4-D-356308.pdf?src-supplier=Mouser; ComponentLink19URL: http://components.arrow.com/part/dataview/61113426S797021N5236?src-supplier=Arrow+Electronics; ComponentLink19Description: http://components.arrow.com/part/dataview/61113426S797021N5236?src-supplier=Arrow+Electronics; ComponentLink20URL: http://www.onsemi.com/pub/Collateral/NSS1C201MZ4-D.PDF?src-supplier=Avnet; ComponentLink20Description: http://www.onsemi.com/pub/Collateral/NSS1C201MZ4-D.PDF?src-supplier=Avnet; ComponentLink21URL: http://www.onsemi.com/pub/Collateral/NSS1C201MZ4-D.PDF?src-supplier=Digi-Key; ComponentLink21Description: http://www.onsemi.com/pub/Collateral/NSS1C201MZ4-D.PDF?src-supplier=Digi-Key; ComponentLink22URL: http://www.farnell.com/datasheets/2237003.pdf?src-supplier=Newark; ComponentLink22Description: http://www.farnell.com/datasheets/2237003.pdf?src-supplier=Newark; ComponentLink23URL: http://www.farnell.com/datasheets/2237003.pdf?src-supplier=Element14; ComponentLink23Description: http://www.farnell.com/datasheets/2237003.pdf?src-supplier=Element14; Supplier Part Number 2: NSV1C201MZ4T1GOSCT-ND
R200-R211 = R470-0805FTK: Res Thick Film 0805 470 Ohm 1% 1/8W ±100ppm/°C Molded SMD SMD Paper Tape on Plastic Reel; Manufacturer 1: Bourns; Power Rating: 125mW; Voltage Rating: 150V; .Creator: DR; Supplier 1: Arrow Electronics; Manufacturer Part Number 1: CR0805-FX-4700GLF; RoHS: Yes; Category: Chip SMD Resistors; Stock 1: 12623; Pricing 1: 1=0,00990, 10=0,00980, 25=0,00950, 50=0,00940, 100=0,00930, 250=0,00920, 500=0,00910, 1000=0,00890, 3000=0,00870, 6000=0,00860 (USD); Mount: Surface Mount; Case/Package: 0805; Number of Pins: 2; Case Code (Imperial): 0805; Case Code (Metric): 2012; Contact Plating: Tin; Min Operating Temperature: -55°C; Max Operating Temperature: 155°C; Packaging: Tape and Reel; Tolerance: 1%; Resistor Type: Thick Film; Termination: SMD/SMT; Temperature Coefficient: 100ppm/°C; Voltage Rating (DC): 150V; Features: Moisture Resistant; Series: CR0805; Max Power Dissipation: 125mW; Number of Terminations: 2; Resistance Tolerance: 1%; Construction: Rectangular; Technology: THICK FILM; Length: 2mm; Height: 0.5mm; Depth: 1.25mm; Thickness: 508um; Radiation Hardening: No; REACH SVHC: No SVHC; Military Standard: Not; ComponentLink1URL: https://datasheet.ciiva.com/11808/0900766b80fcdb72-11808686.pdf?src-supplier=RSComponents; ComponentLink1Description: https://datasheet.ciiva.com/11808/0900766b80fcdb72-11808686.pdf?src-supplier=RSComponents; ComponentLink2URL: https://datasheet.ciiva.com/7985/1856384-7985880.pdf?src-supplier=Element14; ComponentLink2Description: https://datasheet.ciiva.com/7985/1856384-7985880.pdf?src-supplier=Element14; ComponentLink3URL: https://datasheet.ciiva.com/22693/1902866-22693247.pdf?src-supplier=Element14; ComponentLink3Description: https://datasheet.ciiva.com/22693/1902866-22693247.pdf?src-supplier=Element14; ComponentLink4URL: https://datasheet.ciiva.com/5541/chpreztr-5541930.pdf?src-supplier=Mouser; ComponentLink4Description: https://datasheet.ciiva.com/5541/chpreztr-5541930.pdf?src-supplier=Mouser; Supplier Part Number 1: CR0805-FX-4700GLF
R212-R223 = R15-2512FTK: Res Thick Film 2512 15 Ohm 1% 2W ±100ppm/C Pad SMD T/R; Manufacturer 1: TE Connectivity; Temperature Coefficient: 100ppm/°C; Voltage Rating: 250V; Number of Resistors: 1; .Creator: DR; ComponentLink1Description: Datasheet; ComponentLink1URL: https://docs.rs-online.com/8bc1/0900766b81096b90.pdf; ComponentLink2Description: Where buy it; ComponentLink2URL: https://es.rs-online.com/web/p/resistencias-de-montaje-en-superficie/7551110; Supplier 1: RSComponents; Manufacturer Part Number 1: 352115RFT; RoHS: Yes; Category: Chip SMD Resistors; Stock 1: 1; Pricing 1: 10=0,64300, 250=0,62200, 1000=0,60000, 2000=0,55400, 2500=0,52100 (USD); Mount: Surface Mount; Case/Package: 2512; Case Code (Metric): 6432; Case Code (Imperial): 2512; Min Operating Temperature: -55°C; Max Operating Temperature: 155°C; Packaging: Tape and Reel; Tolerance: 1%; Resistor Type: Thick Film,Power resistor; Number of Terminations: 2; Termination: Solder; Voltage Rating (DC): 250V; Features: Automotive AEC-Q200; Series: 3521, CGS; Technology: THICK FILM; Resistance Tolerance: 1%; Length: 6.3mm; Height: 0.55mm; Depth: 3.2mm; RoHS Compliant: Yes; REACH SVHC: No SVHC; ELV: Compliant; ComponentLink3URL: https://datasheet.ciiva.com/25610/0900766b81096b90-25610033.pdf?src-supplier=RSComponents; ComponentLink3Description: https://datasheet.ciiva.com/25610/0900766b81096b90-25610033.pdf?src-supplier=RSComponents; ComponentLink4URL: https://datasheet.ciiva.com/46391/1610601-46391493.pdf?src-supplier=Element14; ComponentLink4Description: https://datasheet.ciiva.com/46391/1610601-46391493.pdf?src-supplier=Element14; ComponentLink5URL: https://datasheet.ciiva.com/7657/1610601-7657542.pdf?src-supplier=Element14; ComponentLink5Description: https://datasheet.ciiva.com/7657/1610601-7657542.pdf?src-supplier=Element14; Supplier Part Number 1: 7551110P; Max Power Dissipation: 2W
R224-R237 R252 = R100-0805FTK: Res Thick Film 0805 100 Ohm 1% 1/8W ±100ppm/°C Molded SMD SMD Paper Tape on Plastic Reel; Manufacturer 1: Bourns; Power Rating: 125mW; Voltage Rating: 150V; .Creator: DR; Supplier 1: Arrow Electronics; Manufacturer Part Number 1: CR0805-FX-1000ELF; RoHS: Yes; Category: Chip SMD Resistors; Stock 1: 49802; Pricing 1: 1=0,05840, 10=0,03430, 25=0,01780, 100=0,00750, 250=0,00560, 500=0,00490, 3000=0,00470 (USD); Mount: Surface Mount; Case/Package: 0805; Number of Pins: 2; Contact Plating: Tin; Case Code (Imperial): 0805; Case Code (Metric): 2012; Min Operating Temperature: -55°C; Max Operating Temperature: 155°C; Tolerance: 1%; Resistor Type: Thick Film; Temperature Coefficient: 100ppm/°C; Packaging: Tape and Reel; Package Quantity: 1; Termination: SMD/SMT; Number of Terminations: 2; Max Power Dissipation: 125mW; Voltage Rating (DC): 150V; Features: Moisture Resistant; Series: CR0805; Resistance Tolerance: 1%; Construction: Rectangular; Technology: THICK FILM; Length: 2mm; Width: 1.25mm; Height: 0.5mm; Depth: 1.25mm; Thickness: 508um; Radiation Hardening: No; REACH SVHC: No SVHC; Military Standard: Not; RoHS Compliant: Yes; ComponentLink1URL: https://datasheet.ciiva.com/11809/0900766b80fcdb72-11809178.pdf?src-supplier=RSComponents; ComponentLink1Description: https://datasheet.ciiva.com/11809/0900766b80fcdb72-11809178.pdf?src-supplier=RSComponents; ComponentLink2URL: https://datasheet.ciiva.com/6547/chpreztr-6547413.pdf?src-supplier=Digi-Key; ComponentLink2Description: https://datasheet.ciiva.com/6547/chpreztr-6547413.pdf?src-supplier=Digi-Key; ComponentLink3URL: https://datasheet.ciiva.com/6547/chpreztr-6547414.pdf?src-supplier=Digi-Key; ComponentLink3Description: https://datasheet.ciiva.com/6547/chpreztr-6547414.pdf?src-supplier=Digi-Key; ComponentLink4URL: https://datasheet.ciiva.com/6547/chpreztr-6547415.pdf?src-supplier=Digi-Key; ComponentLink4Description: https://datasheet.ciiva.com/6547/chpreztr-6547415.pdf?src-supplier=Digi-Key; ComponentLink5URL: https://datasheet.ciiva.com/9120/chpreztr-9120744.pdf?src-supplier=Avnet; ComponentLink5Description: https://datasheet.ciiva.com/9120/chpreztr-9120744.pdf?src-supplier=Avnet; Supplier Part Number 1: CR0805-FX-1000ELF
R238-R251 = R1k-0805FTK: Res Thick Film 0805 1K Ohm 5% 1/8W ±200ppm/°C Molded SMD SMD Paper Tape on Plastic Reel; Manufacturer 1: Bourns; Voltage Rating (DC): 150V; Power Rating: 125mW; .Creator: GP; Supplier 1: Arrow Electronics; Manufacturer Part Number 1: CR0805-JW-102ELF; RoHS: Yes; Category: Chip SMD Resistors; Stock 1: 27510; Pricing 1: 1=0,05930, 10=0,03510, 25=0,01790, 100=0,00800, 250=0,00790, 500=0,00590, 1000=0,00360, 3000=0,00350, 6000=0,00250 (USD); Mount: Surface Mount; Case/Package: 0805; Number of Pins: 2; Contact Plating: Tin; Case Code (Metric): 2012; Case Code (Imperial): 0805; Min Operating Temperature: -55°C; Max Operating Temperature: 155°C; Resistor Type: Thick Film; Tolerance: 5%; Temperature Coefficient: 200ppm/°C; Features: Moisture Resistant; Package Quantity: 1; Packaging: Tape and Reel; Voltage Rating: 150V; Number of Terminations: 2; Termination: SMD/SMT; Max Power Dissipation: 125mW; Length: 2mm; Width: 1.25mm; Height: 0.5mm; Thickness: 508um; Depth: 1.25mm; Radiation Hardening: No; Lead Free: Lead Free; REACH SVHC: No SVHC; Military Standard: Not; ComponentLink1URL: https://datasheet.ciiva.com/11821/0900766b80fcdb72-11821134.pdf?src-supplier=RSComponents; ComponentLink1Description: https://datasheet.ciiva.com/11821/0900766b80fcdb72-11821134.pdf?src-supplier=RSComponents; ComponentLink2URL: https://datasheet.ciiva.com/15225/getdatasheetpartid-78155-15225381.pdf?src-supplier=Verical; ComponentLink2Description: https://datasheet.ciiva.com/15225/getdatasheetpartid-78155-15225381.pdf?src-supplier=Verical; ComponentLink3URL: https://datasheet.ciiva.com/22693/1902866-22693253.pdf?src-supplier=Element14; ComponentLink3Description: https://datasheet.ciiva.com/22693/1902866-22693253.pdf?src-supplier=Element14; ComponentLink4URL: https://datasheet.ciiva.com/7986/1856384-7986184.pdf?src-supplier=Element14; ComponentLink4Description: https://datasheet.ciiva.com/7986/1856384-7986184.pdf?src-supplier=Element14; ComponentLink5URL: https://datasheet.ciiva.com/7985/1856384-7985867.pdf?src-supplier=Element14; ComponentLink5Description: https://datasheet.ciiva.com/7985/1856384-7985867.pdf?src-supplier=Element14; ComponentLink6URL: https://datasheet.ciiva.com/30242/159chpreztr-30242765.pdf?src-supplier=Onlinecomponents.com; ComponentLink6Description: https://datasheet.ciiva.com/30242/159chpreztr-30242765.pdf?src-supplier=Onlinecomponents.com; ComponentLink7URL: https://datasheet.ciiva.com/6547/chpreztr-6547359.pdf?src-supplier=Digi-Key; ComponentLink7Description: https://datasheet.ciiva.com/6547/chpreztr-6547359.pdf?src-supplier=Digi-Key; Supplier Part Number 1: CR0805-JW-102ELF
U201 = U_LTC6811-1: Sc-Automotive Multicell Battery Stack Monitor With Addressable Isospi Interface; Manufacturer 1: Analog Devices; .Creator: GP; ComponentLink1URL: https://www.analog.com/media/en/technical-documentation/data-sheets/ltc6811-1-6811-2.pdf; ComponentLink1Description: Datasheet; ComponentLink2Description: Where buy it; ComponentLink2URL: https://www.mouser.es/ProductDetail/Analog-Devices/LTC6811IG-23ZZTRPBF?qs=byeeYqUIh0NWJgxDt7RX5g%3D%3D; Supplier 1: Digi-Key; Category: Battery Management; Pricing 1: 1=21,46000, 10=19,72200, 25=18,90400, 100=16,65600, 250=15,90600 (USD); RoHS Compliant: Yes; ComponentLink3URL: http://www.linear.com/docs/55980?src-supplier=Digi-Key; ComponentLink3Description: http://www.linear.com/docs/55980?src-supplier=Digi-Key; ComponentLink4URL: https://datasheet.octopart.com/LTC6811HG-1%23PBF-Analog-Devices-datasheet-138896417.pdf?src-supplier=Upverter; ComponentLink4Description: https://datasheet.octopart.com/LTC6811HG-1%23PBF-Analog-Devices-datasheet-138896417.pdf?src-supplier=Upverter; ComponentLink5URL: https://datasheet.octopart.com/LTC6811HG-1%23PBF-Linear-Technology-datasheet-66874450.pdf?src-supplier=Linear+Technology; ComponentLink5Description: https://datasheet.octopart.com/LTC6811HG-1%23PBF-Linear-Technology-datasheet-66874450.pdf?src-supplier=Linear+Technology; ComponentLink6URL: https://sigma.octopart.com/57702806/technical_drawing/Linear-Technology-LTC6811HG-1%23PBF.pdf?src-supplier=Linear+Technology; ComponentLink6Description: https://sigma.octopart.com/57702806/technical_drawing/Linear-Technology-LTC6811HG-1%23PBF.pdf?src-supplier=Linear+Technology; Supplier Part Number 1: 505-LTC6811HG-1#PBF-ND; Case/Package: SSOP; Manufacturer Part Number 1: LTC6811-1